# Altium schematic sheet SAI.SchDoc
size A4; DocumentNumber: 11; SheetNumber: 11; SheetTotal: 15
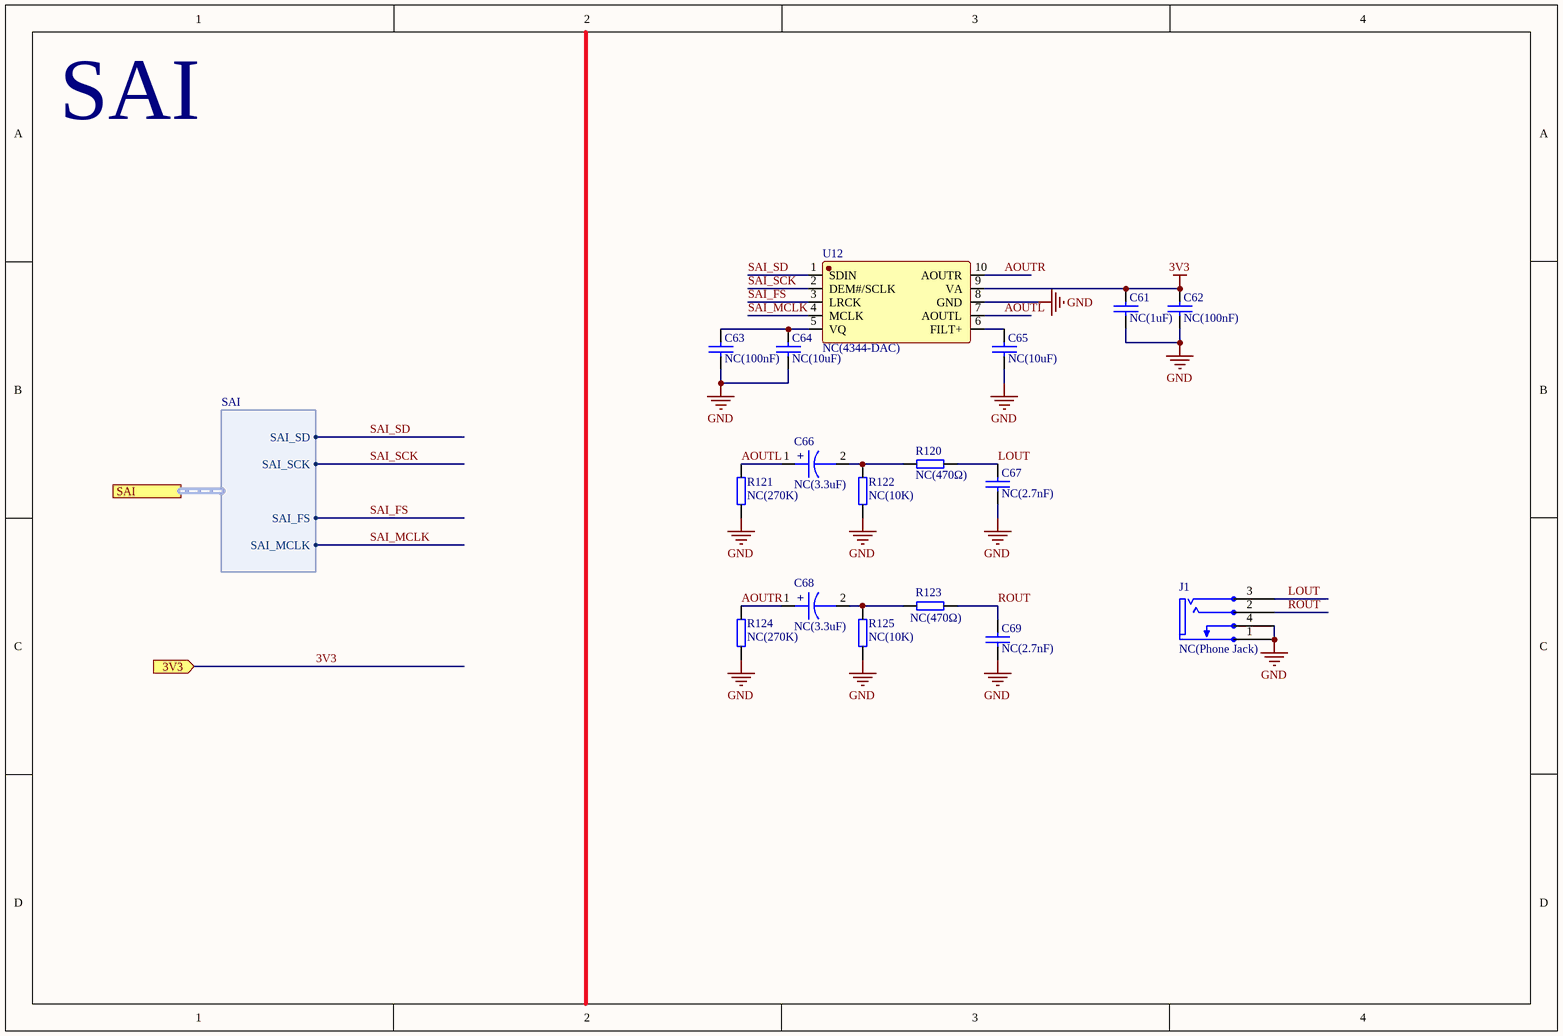
[diagram p0: SAI.SchDoc]

## Parts
C61  NC(1uF)  [0402_C]
C62  NC(100nF)  [0402_C]
C63  NC(100nF)  [0402_C]
C64  NC(10uF)  [0603_C]
C65  NC(10uF)  [0603_C]
C66  NC(3.3uF)  [CAP-TH_BD5.0-P2.00-D0.8-FD]
C67  NC(2.7nF)  [0402_C]
C68  NC(3.3uF)  [CAP-TH_BD5.0-P2.00-D0.8-FD]
C69  NC(2.7nF)  [0402_C]
J1  NC(Phone Jack)  [3.5MMEARPHONE]
R120  NC(470Ω)  [0402]
R121  NC(270K)  [0402]
R122  NC(10K)  [0402]
R123  NC(470Ω)  [0402]
R124  NC(270K)  [0402]
R125  NC(10K)  [0402]
U12  NC(4344-DAC)  [TSSOP-10_L3.0-W3.0-P0.50-LS4.9-BL]

## Ports
3V3 (in), SAI (harness SAI)

## Harnesses
SAI: SAI_SD, SAI_SCK, SAI_FS, SAI_MCLK

## Nets
3V3: C61.2 C62.2 U12.9(VA) ; port 3V3
GND: C61.1 C62.1 C63.1 C64.1 C65.1 C67.1 C69.1 J1.1 J1.4 R121.2 R122.2 R124.2 R125.2 U12.8(GND)
AOUTL: C66.1 R121.1 U12.7(AOUTL)
AOUTR: C68.1 R124.1 U12.10(AOUTR)
LOUT: C67.2 J1.3 R120.2
ROUT: C69.2 J1.2 R123.2
SAI_FS: U12.3(LRCK) ; port SAI.SAI_FS
SAI_MCLK: U12.4(MCLK) ; port SAI.SAI_MCLK
SAI_SCK: U12.2(DEM#/SCLK) ; port SAI.SAI_SCK
SAI_SD: U12.1(SDIN) ; port SAI.SAI_SD
NetC63_2: C63.2 C64.2 U12.5(VQ)
NetC65_2: C65.2 U12.6(FILT+)
NetC66_2: C66.2 R120.1 R122.1
NetC68_2: C68.2 R123.1 R125.1

## Notes on the sheet
- SAI
- (in symbol CAPACITOR POL) +

## Library data of the parts
C61-C65 C67 C69 = CAP: Capacitor
C66 C68 = CAPACITOR POL: 3.3uF
J1 = Phone Jack
R120-R125 = RES
U12 = CS4344-CZZ